# Altium schematic sheet AD8233.SchDoc: Наименование
size 420 x 297 mm; Author: Мингалеев А.А.; SheetNumber: 1; SheetTotal: 1; PageSetup: Record=PageOptions|CenterHorizontal=True|CenterVertical=True|PrintScale=0.94|XCorrection=1.00|YCorrection=1.00|PrintKind=1|BorderSize=5000000|LeftOffset=0|BottomOffset=0|Orientation=1|PaperLength=1000|PaperWidth=1000|Scale=100|PaperSource=7|PrintQuality=-4|MediaType=1|DitherType=10|PaperKind=A4|PrintScaleMode=1; MainDevice: Перв.примен.; Name: Тестовое задание; DocumentName: Sheet1.SCHDOC
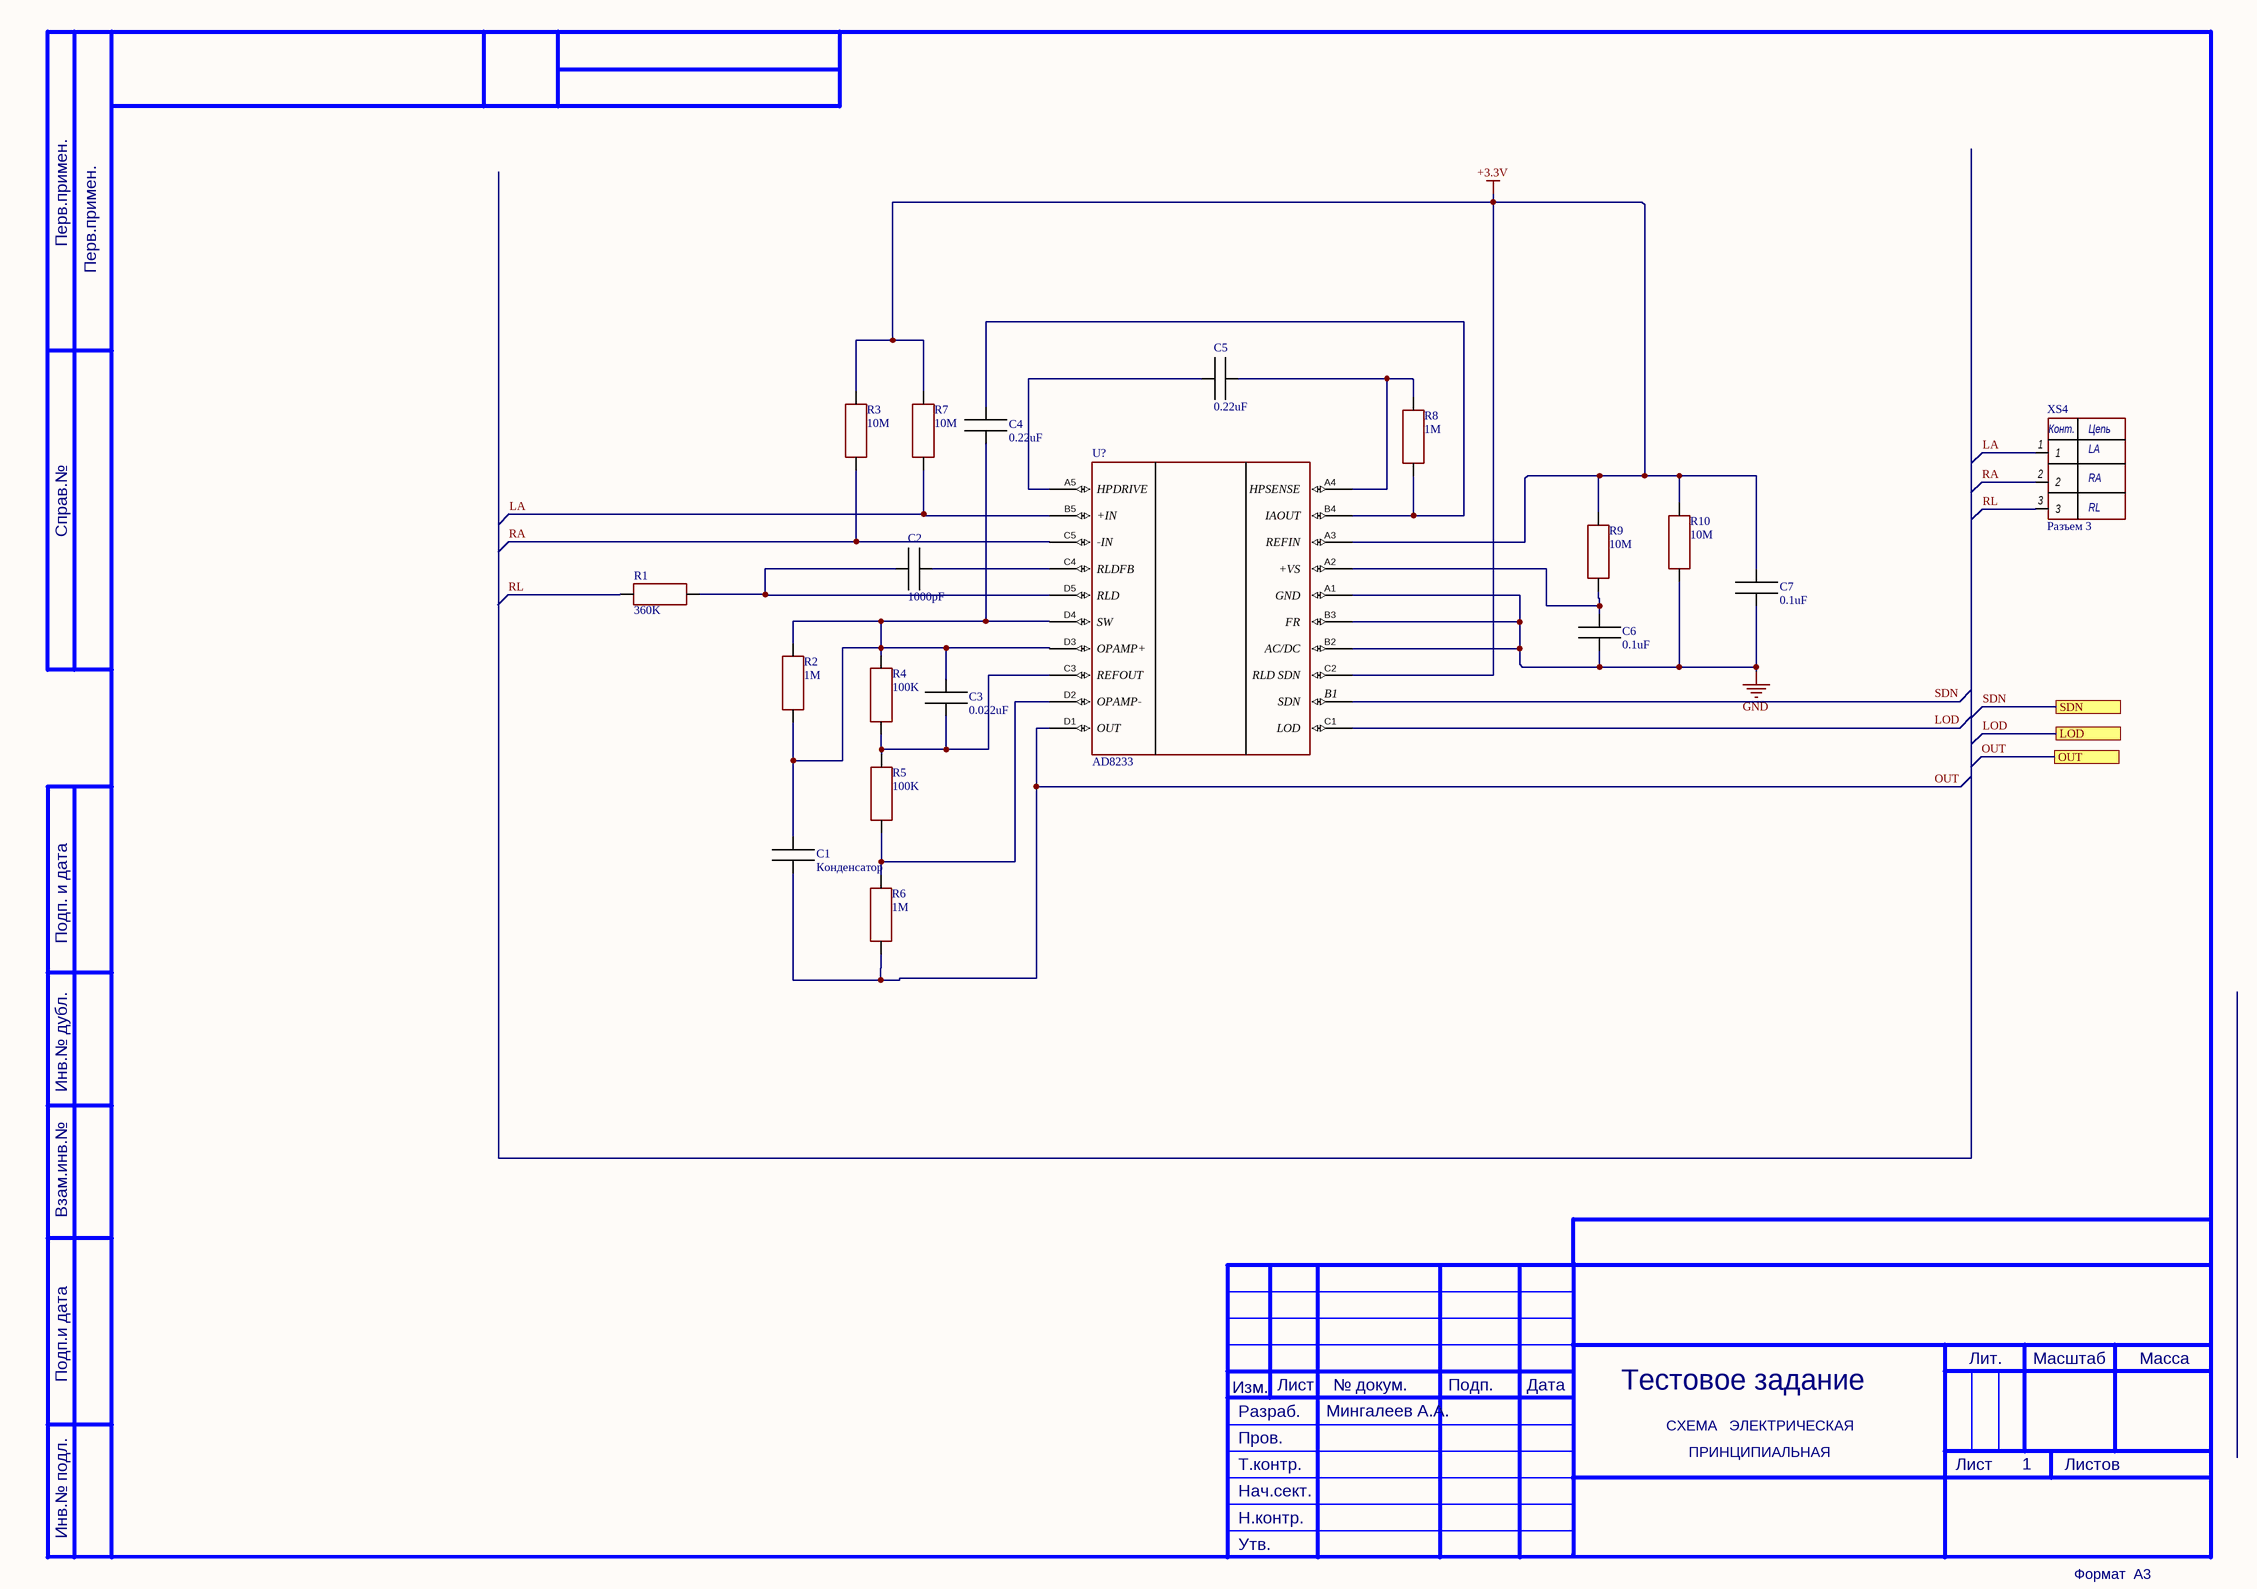
[diagram p0: AD8233.SchDoc]

## Parts
C1  Конденсатор  [0402]
C2  1000pF  [0402]
C3  0.022uF  [0402]
C4  0.22uF  [0402]
C5  0.22uF  [0402]
C6  0.1uF  [0402]
C7  0.1uF  [0402]
R1  360K  [0402]
R2  1M  [0402]
R3  10M  [0402]
R4  100K  [0402]
R5  100K  [0402]
R6  1M  [0402]
R7  10M  [0402]
R8  1M  [0402]
R9  10M  [0402]
R10  10M  [0402]
U?  AD8233  [WLCSP]
XS4  Разъем 3  [PIN 3]

## Ports
LOD, OUT, SDN

## Nets
+3.3V: C7.2 R3.2 R7.2 R9.2 R10.2 U?.A3(REFIN) U?.C2(RLD_SDN)
GND: C6.1 C7.1 R10.1 U?.A1(GND) U?.B2(AC/DC) U?.B3(FR)
LA: R7.1 U?.B5(+IN) XS4.1
LOD: port LOD
OUT: C1.1 R6.1 U?.D1(OUT) ; port OUT
RA: R3.1 U?.C5(-IN) XS4.2
RL: R1.2 XS4.3
SDN: port SDN
NetC1_2: C1.2 C3.2 C4.1 R2.1 R2.2 R4.2 U?.D3(OPAMP+) U?.D4(SW)
NetC2_1: C2.1 U?.C4(RLDFB)
NetC2_2: C2.2 R1.1 U?.D5(RLD)
NetC3_1: C3.1 R4.1 R5.2 U?.C3(REFOUT)
NetC4_2: C4.2 R8.1 U?.B4(IAOUT)
NetC5_1: C5.1 R8.2 U?.A4(HPSENSE)
NetC5_2: C5.2 U?.A5(HPDRIVE)
NetC6_2: C6.2 R9.1 U?.A2(+VS)
NetR5_1: R5.1 R6.2 U?.D2(OPAMP-)

Not connected (* = marked no-connect by the designer): U? B1(SDN_) C1(LOD_)

## Notes on the sheet
- (near XS4) LA
- (near XS4) RA
- (near XS4) RL
- Labels drawn without touching a wire or pin: LOD, SDN
- Перв.примен.
- Справ.№
- Подп. и дата
- Инв.№ дубл.
- Взам.инв.№
- Подп.и дата
- Разраб.
- Изм.
- Лист
- № докум.
- Подп.
- Дата
- Лит.
- Масштаб
- Масса
- Т.контр.
- Пров.
- СХЕМА   ЭЛЕКТРИЧЕСКАЯ
- ПРИНЦИПИАЛЬНАЯ
- Листов
- Инв.№ подл.
- Утв.
- Н.контр.
- Нач.сект.
- Формат  A3
- (in symbol Разъем 3) Конт.; Цепь

## Library data of the parts
C2-C7 = Конденсатор
R1-R10 = Резистор